# EAGLE design FumeDisperser (EAGLE 7.7.0)
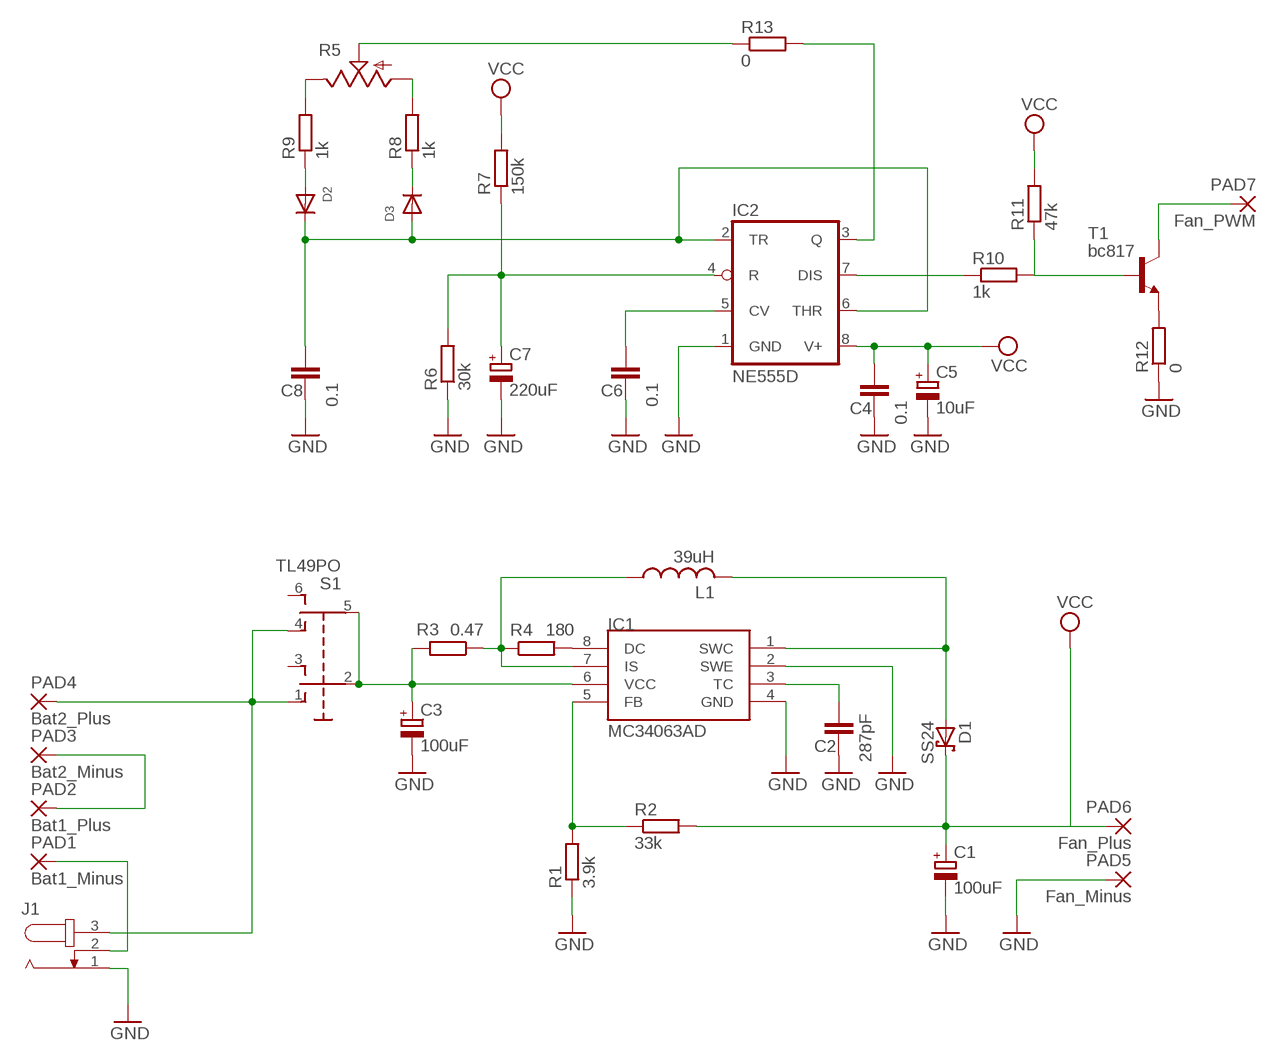
[diagram p0: schematic, sheet 1]

## Parts
C1  100uF  CPOL-EUD/7343-31R  [D/7343-31R]
C2  287pF  C-EUC1206  [C1206]
C3  100uF  CPOL-EUD/7343-31R  [D/7343-31R]
C4  0.1  C-EUC1206  [C1206]
C5  10uF  CPOL-EUD/7343-31R  [D/7343-31R]
C6  0.1  C-EUC1206  [C1206]
C7  220uF  CPOL-EUD/7343-31R  [D/7343-31R]
C8  0.1  C-EUC1206  [C1206]
D1  SS24  SCHOTTKY-DIODESMD  [SMB]
D2  DIODESOD-123  [SOD-123]
D3  DIODESOD-123  [SOD-123]
IC1  MC34063AD  [SOIC8]
IC2  NE555D  [SO08]
J1  JACK-PLUG0  [SPC4077]
L1  39uH  L-USL3225P  [L3225P]
PAD1  Bat1_Minus  SMD5  [SMD2,54-5,08]
PAD2  Bat1_Plus  SMD5  [SMD2,54-5,08]
PAD3  Bat2_Minus  SMD5  [SMD2,54-5,08]
PAD4  Bat2_Plus  SMD5  [SMD2,54-5,08]
PAD5  Fan_Minus  SMD5  [SMD2,54-5,08]
PAD6  Fan_Plus  SMD5  [SMD2,54-5,08]
PAD7  Fan_PWM  SMD5  [SMD2,54-5,08]
R1  3.9k  R-EU_M1206  [M1206]
R2  33k  R-EU_M1206  [M1206]
R3  0.47  R-EU_M1206  [M1206]
R4  180  R-EU_M1206  [M1206]
R5  US-EVUF2A  [EVUF]
R6  30k  R-EU_M1206  [M1206]
R7  150k  R-EU_M1206  [M1206]
R8  1k  R-EU_M1206  [M1206]
R9  1k  R-EU_M1206  [M1206]
R10  1k  R-EU_M1206  [M1206]
R11  47k  R-EU_M1206  [M1206]
R12  0  R-EU_M1206  [M1206]
R13  0  R-EU_M1206  [M1206]
S1  TL49PO  [TL4XPO]
T1  bc817  BC817-16-NPN-SOT23-BEC  [SOT23-BEC]

## Nets
GND: C1.- C2.2 C3.- C4.2 C5.- C6.2 C7.- C8.2 IC1.2(SWE) IC1.4(GND) IC2.1(GND) J1.1 PAD5.1(P) R1.1 R6.1 R12.1
N$1: D1.A IC1.1(SWC) L1.2
N$2: C6.1 IC2.5(CV)
N$3: IC1.5(FB) R1.2 R2.1
N$4: C3.+ IC1.6(VCC) R3.2 S1.2(P) S1.5(P1)
N$5: IC1.7(IS) L1.1 R3.1 R4.1
N$6: IC1.8(DC) R4.2
N$7: C2.1 IC1.3(TC)
N$9: PAD2.1(P) PAD3.1(P)
N$10: J1.3 PAD4.1(P) S1.1(O) S1.4(O1)
N$11: C8.1 D2.C D3.A IC2.2(TR) IC2.6(THR)
N$19: J1.2 PAD1.1(P)
N$27: R5.2(S) R13.1
N$29: C7.+ IC2.4(R) R6.2 R7.1
N$30: D3.C R8.1
N$31: D2.A R9.1
N$32: R5.3(E) R9.2
N$33: R5.1(A) R8.2
N$34: IC2.3(Q) R13.2
N$35: IC2.7(DIS) R10.1
N$36: R10.2 R11.1 T1.B
N$37: PAD7.1(P) T1.C
N$42: R12.2 T1.E
VCC: C1.+ C4.1 C5.+ D1.C IC2.8(V+) PAD6.1(P) R2.2 R7.2 R11.2
Unconnected: S1.3(S) S1.6(S1)

## Library data of the parts
C1 C3 C5 C7 = rcl:CPOL-EU: POLARIZED CAPACITOR, European symbol
C2 C4 C6 C8 = resistor:C-EU: CAPACITOR, European symbol
D1 = diode:SCHOTTKY-DIODE: Schottky Diode
D2 D3 = adafruit:DIODE: Diode SMADIODE - SMA Surface Mount Package 20V 1A Schottky Diode Digikey: 641-1014-6-ND DO-1N4148 - Through Hole Small Current Diode SOD-123 20V 1 A (.5mV Vf) Schottky Diode - Digikey: MBRX120TPMSCT-ND SOD-323 10V 570mA (.38mV Vf, 3ns) Schottky Diode - Digikey: ZLLS410CT-ND SOD-523 30V 30mA Schottky Diode (RB751S-40TE61) - Digikey: RB751S-40TE61CT-ND SOT23-R/W - SOT23 Package (R = Solder Paste/Reflow Ovens, W = Hand-Soldering) BAT54Film 40V 300mA - Digikey: 497-7162-1-ND
IC1 = mc34063:MC34063
IC2 = linear:*555: TIMER
J1 = con-jack:JACK-PLUG: DC POWER JACK Power Jack, DC, Right Angle, Through Hole, Rated 5A at 16VDC, PC Terminals Distributor: Farnell (www.Farnell.de) Drawing: 84N1161.pdf / 84N1162.pdf Manufacturer: SPC Technology (www.spctechnology.com) Type: SPC4077 / SPC 4078; OC_FARNELL: unknown; OC_NEWARK: unknown
L1 = rcl:L-US: INDUCTOR, American symbol
PAD1-PAD7 = wirepad:SMD5: SMD PAD
R1-R4 R6-R13 = resistor:R-EU_: RESISTOR, European symbol
R5 = pot:US-EVU: 9 mm Square Rotary Potentiometers Source: Panasonic
S1 = switch:TL49PO: TINY SWITCH ON OFF ON Source: http://www2.produktinfo.conrad.com/datenblaetter/700000-724999/705152-da-01-de-Subminiaturschalter_TL_36YO.pdf
T1 = transistor:*-NPN-: NPN Transistror BF959 corrected 2008.03.06

## Board
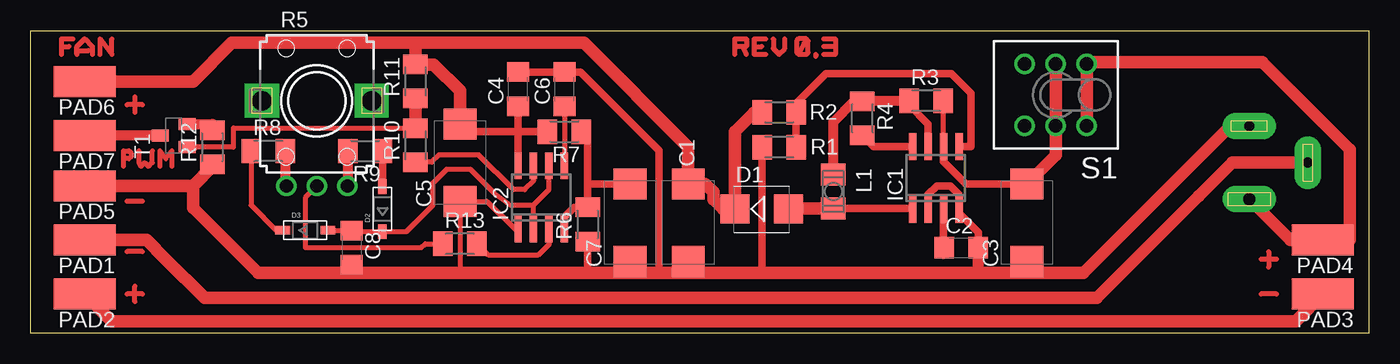
[diagram p1: board, top side]
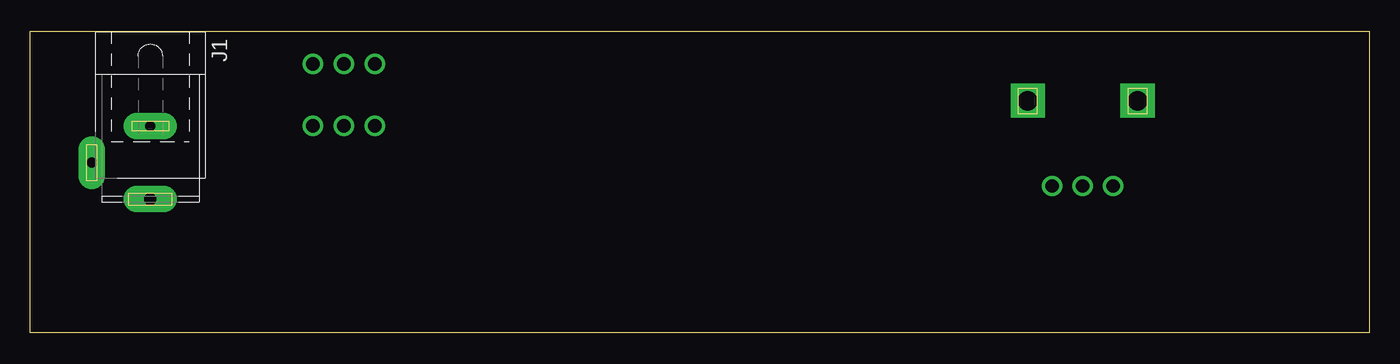
[diagram p2: board, bottom side, seen from below]

Size 109.84 x 24.75 mm. Coordinates in mm from the lower left corner, seen from the top.
Outline: 0,0 109.84,0 109.84,24.75 0,24.75 0,0
Copper layers (1*16): Top 0.035mm / dielectric 1.5mm / Bottom 0.035mm
Design rules "default": minimum track width 10mil, minimum drill 24mil, track to track 8mil, track to pad 8mil, pad to pad 8mil, via to via 8mil, smd to smd 8mil, copper to edge 40mil, drill to drill 8mil, minimum pad ring 10mil, minimum via ring 8mil, stop-mask expansion 4mil, vias tented up to drill 0mil, thermal gap 10mil

### Footprints (pad centres in the part's own frame; a part is rotated, then mirrored left to right if it is on the bottom)
D/7343-31R = smd 2.55 x 2.7: + 3.175,0; - -3.175,0
C1206 = smd 1.6 x 1.8: 1 -1.4,0; 2 1.4,0
SMB = smd 2.4 x 2.4: A 2.2,0; C -2.2,0
SOD-123 = smd 1.2 x 0.7: A 1.85,0; C -1.85,0
SOIC8 = smd 0.6 x 2.2: 1 -1.905,-2.6; 2 -0.635,-2.6; 3 0.635,-2.6; 4 1.905,-2.6; 5 1.905,2.6; 6 0.635,2.6; 7 -0.635,2.6; 8 -1.905,2.6
SO08 = smd 0.6 x 2.2: 1 -1.905,-2.6; 2 -0.635,-2.6; 3 0.635,-2.6; 4 1.905,-2.6; 5 1.905,2.6; 6 0.635,2.6; 7 -0.635,2.6; 8 -1.905,2.6
SPC4077 = drill 0.8 pad 2.184 long: 1 -3,0; 2 0,-4.8 | drill 1 pad 2.184 long: 3 3,0
L3225P = smd 1.8 x 2: 1 -1.4,0; 2 1.4,0
SMD2,54-5,08 = smd 2.54 x 5.08: 1 0,0
M1206 = smd 1.6 x 2: 1 -1.4,0; 2 1.4,0
EVUF = drill 1.1 pad 1.676: 1 -2.5,-7; 2 0,-7; 3 2.5,-7 | drill 1.6 pad 2.8 square: M1 4.5,0; M2 -4.5,0
TL4XPO = drill 1.1 pad 1.676: 1 -2.54,2.54; 2 0,2.54; 3 2.54,2.54; 4 -2.54,-2.54; 5 0,-2.54; 6 2.54,-2.54
SOT23-BEC = smd 1 x 1.4: B -0.95,-1.1; C 0,1.1; E 0.95,-1.1

### Placement (x,y rotation side)
C1  53.98,9.05 90 top
C2  76.36,6.99 0 top
C3  81.76,9.05 90 top
C4  40.01,20 90 top
C5  35.24,13.97 90 top
C6  43.81,20 90 top
C7  49.21,9.05 90 top
C8  26.35,6.99 270 top
D1  60.01,10.16 0 top
D2  28.89,10.16 90 top
D3  22.54,8.41 0 top
IC1  74.29,12.7 0 top
IC2  41.91,11.11 0 top
J1  100.01,13.97 270 bottom
L1  65.88,11.59 270 top
PAD1  4.45,7.62 90 top
PAD2  4.45,3.17 90 top
PAD3  106.04,3.17 90 top
PAD4  106.04,7.62 90 top
PAD5  4.45,12.06 90 top
PAD6  4.45,20.64 90 top
PAD7  4.45,16.19 90 top
R1  61.44,15.24 0 top
R2  61.44,18.1 180 top
R3  73.5,19.05 0 top
R4  68.26,17.62 270 top
R5  23.5,19.05 0 top
R6  45.72,8.89 90 top
R7  43.81,16.51 180 top
R8  19.53,14.92 0 top
R9  27.46,14.92 180 top
R10  31.59,15.4 90 top
R11  31.59,20.64 90 top
R12  14.92,15.24 90 top
R13  35.24,7.3 0 top
S1  84.14,19.53 180 top
T1  11.75,16.19 90 top

### Tracks (layer width: path | path; a pad name or v marks a point on that pad's centre or on a via)
GND
  Top 0.406: IC1.4 76.2,9.84 | 77.79,6.35 C2.2 | R12.1 14.92,13.65 | 35.24,4.92 C5.- 37.47,10.79 39.75,8.51 IC2.1 | C8.2 26.35,4.92
  Top 0.61: 76.2,9.84 77.79,8.26 77.79,6.35 | IC1.2 73.66,11.36 74.37,12.06 75.49,12.06 76.2,11.36 IC1.4 | R1.1 60.04,4.92 | C7.- 50.16,4.92 50.48,4.92 | R6.1 45.72,4.92 | C4.2 C6.2 45.16,21.4 51.59,14.96 51.59,4.92
  Top 0.813: 77.76,4.92 C2.2 | J1.1 98.45,16.97 | 53.98,4.92 C1.- | 77.79,6.35 77.79,4.92 | C3.- 81.76,4.92
  Top 1.016: PAD5.1 13.34,12.06 | 13.34,12.06 13.34,10.26 18.67,4.92 26.35,4.92 35.24,4.92 45.72,4.92 50.48,4.92 51.59,4.92 53.98,4.92 60.04,4.92 77.76,4.92 | 98.45,16.97 86.4,4.92 81.76,4.92 77.79,4.92 | 14.92,13.65 13.34,12.06
N$1
  Top 0.406: IC1.1 72.39,10.19 | D1.A 62.52,10.19
  Top 0.61: 72.39,10.19 L1.2
  Top 1.016: 62.52,10.19 L1.2
N$2
  Top 0.406: C6.1 IC2.5
N$3
  Top 0.61: IC1.5 77.15,15.3 77.15,19.68 75.56,21.27 65.28,21.27 62.84,18.83 R2.1 R1.2
N$4
  Top 0.406: IC1.6 74.93,18.89 R3.2
  Top 0.61: IC1.6 74.93,14.04 76.75,12.22 C3.+
  Top 1.016: C3.+ 84.14,14.61 S1.2 S1.5
N$5
  Top 0.406: R4.1 68.26,19.05 | 72.07,18.73 72.07,18.89 R3.1
  Top 0.61: IC1.7 73.66,17.14 72.07,18.73
  Top 0.813: 68.26,19.05 R3.1 | L1.1 65.88,17.32 67.58,19.02 R4.1
N$6
  Top 0.61: R4.2 69.18,15.3 IC1.8
N$7
  Top 0.406: 74.93,6.35 C2.1
  Top 0.61: IC1.3 74.93,6.35
N$8
  Top 0.406: 102.24,6.03 100.97,6.03
N$9
  Top 1.016: PAD2.1 6.67,0.95 103.82,0.95 PAD3.1
N$10
  Top 0.813: PAD4.1 108.27,7.62 | 86.68,22.23 S1.4
  Top 1.016: S1.4 S1.1 | 108.27,7.62 108.27,15.03 101.07,22.23 86.68,22.23 | PAD4.1 103.36,7.62 J1.3
N$11
  Top 0.406: IC2.2 41.27,10.48 | 41.27,10.48 42.55,11.75 IC2.6 | 41.27,10.48 39.37,10.48 38.1,11.43 36.12,13.41 34.13,13.41 33.02,12.3 33.02,10.48 30.85,8.31 D2.C 26.43,8.31 C8.1 24.42,8.38 D3.A
N$12
  Top 0.406: 101.6,6.67 101.6,5.4
N$13
  Top 0.406: 102.24,3.17 100.97,3.17 | 9.21,3.17 7.94,3.17 | 9.21,6.67 7.94,6.67 | 9.21,10.79 7.94,10.79 | 9.21,18.73 7.94,18.73 | 8.57,19.37 8.57,18.1
N$14
  Top 0.406: 8.57,2.54 8.57,3.81
N$15
  Top 0.406: 2.54,22.86 2.54,24.13 3.49,24.13
N$16
  Top 0.406: 2.54,23.5 3.18,23.5
N$17
  Top 0.406: 3.81,22.86 3.81,23.18 | 3.81,23.18 3.81,23.5 4.45,24.13 5.08,23.5 5.08,22.86 | 3.81,23.18 4.76,23.18
N$18
  Top 0.406: 5.71,22.86 5.71,24.13 6.67,22.86 6.67,24.13
N$19
  Top 1.016: PAD1.1 9.53,7.62 11.11,6.03 14.29,2.86 87.5,2.86 95.88,11.24 98.62,13.97 J1.2
N$20
  Top 0.406: 57.79,23.5 57.79,24.13 58.74,24.13 58.74,23.5 58.42,23.5 | 57.79,23.5 57.79,22.86 | 58.42,23.5 57.79,23.5 | 58.42,23.5 58.74,22.86
N$22
  Top 0.406: 59.37,23.5 59.37,24.13 60.33,24.13 | 59.37,23.5 59.37,22.86 60.33,22.86 | 59.37,23.5 60.01,23.5
N$23
  Top 0.406: 60.96,24.13 60.96,23.34 61.44,22.86 61.91,23.34 61.91,24.13
N$24
  Top 0.406: 62.87,23.97 62.87,23.02 63.02,22.86 63.66,22.86 63.82,23.02 63.82,23.97 63.66,24.13 63.02,24.13 62.87,23.97
N$25
  Top 0.406: 63.18,23.18 63.5,23.81
N$26
  Top 0.406: 65.09,24.13 66.04,24.13 66.04,23.5 | 66.04,23.5 65.09,23.5 | 66.04,23.5 66.04,22.86
N$27
  Top 0.406: R5.2 22.54,11.1 22.54,6.99 32.07,6.99 32.39,7.3 R13.1
N$28
  Top 0.406: 64.45,22.86 64.45,22.7
N$29
  Top 0.61: IC2.4 43.81,9.51 44.59,10.29 R6.2 45.72,12.06 45.72,12.22 | R7.1 45.72,16.51 45.72,12.22 | C7.+ 45.72,12.22
N$30
  Top 0.406: 18.1,14.92 18.1,10.48 20.16,8.41 D3.C
  Top 0.61: R8.1 18.1,14.92
N$31
  Top 0.61: R9.1 28.89,14.92 D2.A
N$32
  Top 0.61: R5.3 26.06,12.05
  Top 0.813: 26.06,12.05 R9.2
N$33
  Top 0.61: R5.1 20.93,12.05
  Top 0.813: 20.93,12.05 R8.2
N$34
  Top 0.406: IC2.3 42.55,7.25 41.65,6.35 37.59,6.35 R13.2
N$35
  Top 0.406: IC2.7 41.27,12.46 40.56,11.75 39.63,11.75 36.78,14.61 33.53,14.61 32.92,14 R10.1
N$36
  Top 0.406: 13.48,15.24 16.67,15.24 16.67,16.83 31.59,16.83
  Top 0.61: 13.48,15.24 T1.B
  Top 1.016: R11.1 31.59,16.83 R10.2
N$37
  Top 0.813: T1.C PAD7.1
N$38
  Top 0.406: 65.09,22.86 66.04,22.86
N$39
  Top 0.406: 7.62,14.29 7.62,14.92 8.1,14.92 8.26,14.76 8.26,14.45 8.1,14.29 7.62,14.29 | 7.62,14.29 7.62,13.65
N$40
  Top 0.406: 8.89,14.92 8.89,13.97 9.05,13.65 9.37,13.97 9.68,13.65 10,13.97 10,14.92
N$41
  Top 0.406: 10.64,13.65 10.64,14.92 11.11,14.29 11.59,14.92 11.59,13.65
N$42
  Top 0.813: T1.E 14.92,17.14 R12.2
VCC
  Top 0.406: 31.59,23.81 31.75,23.81 | C5.+ 35.88,16.51
  Top 0.61: 40.01,14.29 IC2.8 40.01,16.51 | 40.01,16.51 C4.1 | 37.47,23.81 37.15,23.81 | R7.2 40.01,16.51 | 35.88,16.51 40.01,16.51
  Top 0.813: 56.83,10.16 D1.C
  Top 1.016: D1.C 57.81,16.53 59.38,18.1 R2.2 | 56.83,10.16 56.04,10.95 56.04,11.55 55.37,12.22 C1.+ 53.98,15.26 45.43,23.81 37.15,23.81 31.75,23.81 16.51,23.81 13.34,20.64 PAD6.1 | 31.59,23.81 R11.2 33.09,22.04 35.24,19.89 C5.+